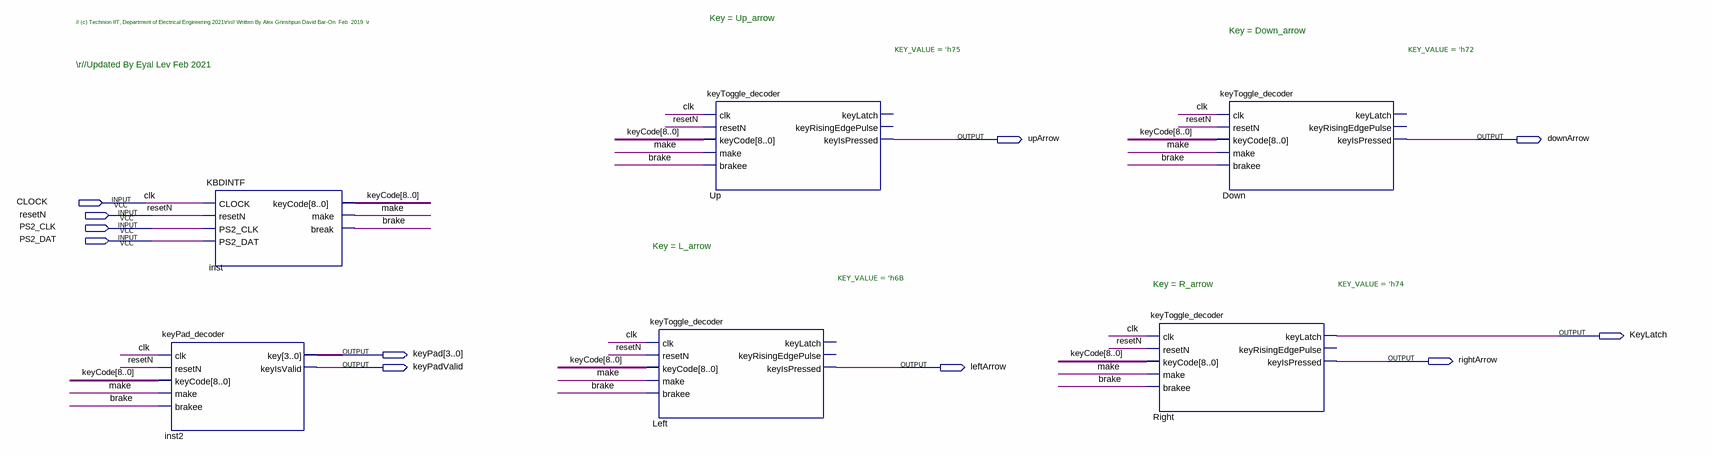
[diagram p0: schematic sheet]
// Quartus schematic KEYBOARD_INTERFACE.bdf as structural Verilog: 6 symbols, 11 pins
module KEYBOARD_INTERFACE (
  input  CLOCK,
  input  resetN,
  input  PS2_CLK,
  input  PS2_DAT,
  output upArrow,
  output downArrow,
  output KeyLatch,
  output [3:0] keyPad,
  output rightArrow,
  output keyPadValid,
  output leftArrow
);

  wire brake, make;
  wire [8:0] keyCode;

  keyPad_decoder inst2 (
    .clk(CLOCK), .resetN(resetN), .keyCode(keyCode), .make(make), .brakee(brake), .key(keyPad),
    .keyIsValid(keyPadValid));
  KBDINTF inst (
    .CLOCK(CLOCK), .resetN(resetN), .PS2_CLK(PS2_CLK), .PS2_DAT(PS2_DAT), .keyCode(keyCode), .make(make),
    .\break (brake));
  keyToggle_decoder #(.KEY_VALUE('h6B)) Left (
    .clk(CLOCK), .resetN(resetN), .keyCode(keyCode), .make(make), .brakee(brake), .keyIsPressed(leftArrow));  // open: keyLatch, keyRisingEdgePulse
  keyToggle_decoder #(.KEY_VALUE('h75)) Up (
    .clk(CLOCK), .resetN(resetN), .keyCode(keyCode), .make(make), .brakee(brake), .keyIsPressed(upArrow));  // open: keyLatch, keyRisingEdgePulse
  keyToggle_decoder #(.KEY_VALUE('h74)) Right (
    .clk(CLOCK), .resetN(resetN), .keyCode(keyCode), .make(make), .brakee(brake), .keyLatch(KeyLatch),
    .keyIsPressed(rightArrow));  // open: keyRisingEdgePulse
  keyToggle_decoder #(.KEY_VALUE('h72)) Down (
    .clk(CLOCK), .resetN(resetN), .keyCode(keyCode), .make(make), .brakee(brake), .keyIsPressed(downArrow));  // open: keyLatch, keyRisingEdgePulse

  // Other names for the same wires on the sheet: clk = CLOCK

  // Notes on the sheet:
  //   Key = Up_arrow
  //   // (c) Technion IIT, Department of Electrical Engineering 2021\r\n// Written By Alex Grinshpun David Bar-On  Feb  2019  \r
  //   Key = Down_arrow
  //   \r//Updated By Eyal Lev Feb 2021
  //   Key = L_arrow
  //   Key = R_arrow
endmodule
